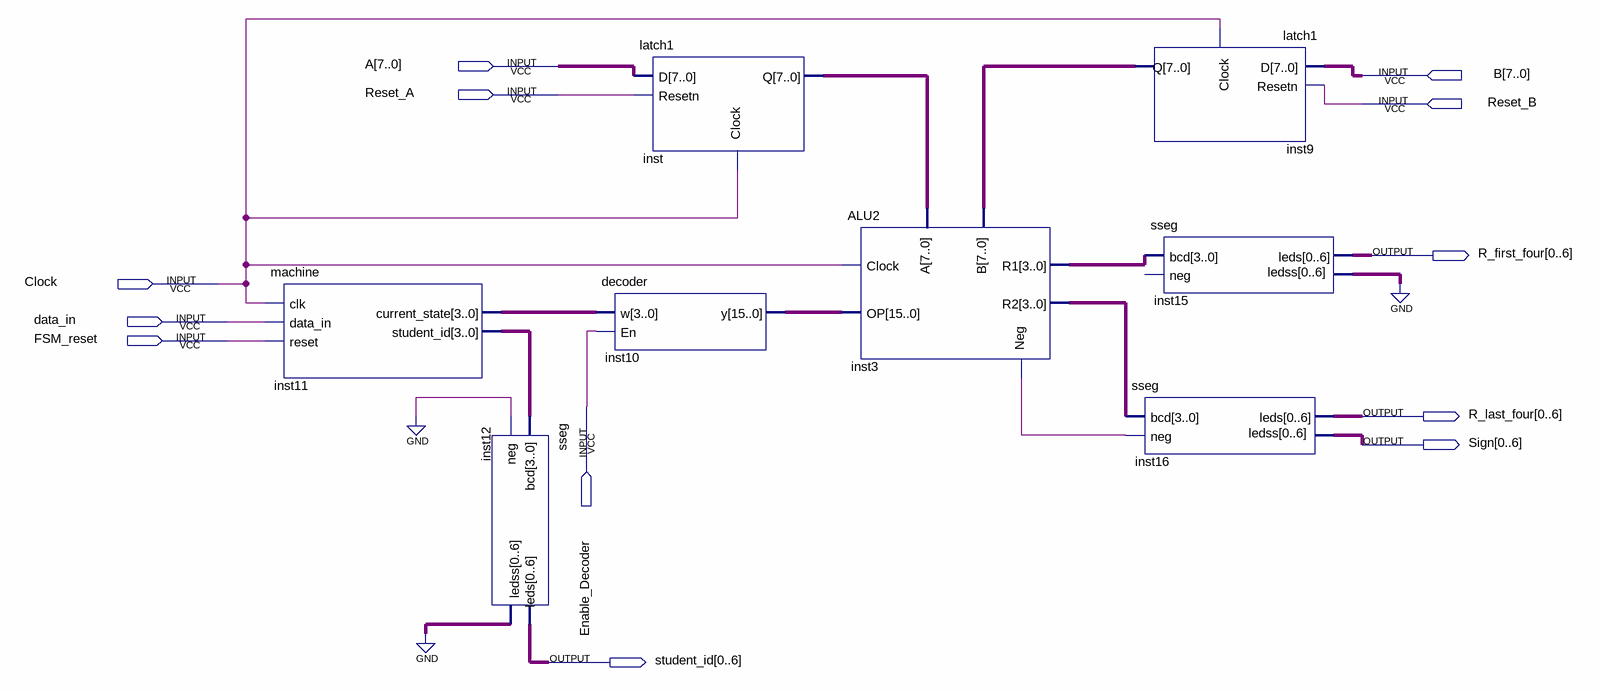
[diagram p0: schematic sheet]
// Quartus schematic problem2.bdf as structural Verilog: 8 symbols, 12 pins
module problem2 (
  input  [7:0] A,
  input  [7:0] B,
  input  Reset_A,
  input  Reset_B,
  input  Clock,
  input  data_in,
  input  FSM_reset,
  input  Enable_Decoder,
  output [0:6] R_first_four,
  output [0:6] R_last_four,
  output [0:6] Sign,
  output [0:6] student_id
);

  wire inst3_neg;
  wire [3:0] inst3_r1, inst3_r2, inst11_current_state, inst11_student_id;
  wire [6:0] inst12_ledss, inst15_ledss;
  wire [7:0] inst9_q, inst_q;
  wire [15:0] inst10_y;

  machine inst11 (
    .clk(Clock), .data_in(data_in), .reset(FSM_reset), .student_id(inst11_student_id),
    .current_state(inst11_current_state));
  sseg inst12 (.bcd(inst11_student_id), .neg(1'b0), .leds(student_id), .ledss(inst12_ledss));
  latch1 inst (.D(A), .Resetn(Reset_A), .Clock(Clock), .Q(inst_q));
  decoder inst10 (.w(inst11_current_state), .En(Enable_Decoder), .y(inst10_y));
  ALU2 inst3 (.Clock(Clock), .A(inst_q), .B(inst9_q), .OP(inst10_y), .Neg(inst3_neg), .R1(inst3_r1), .R2(inst3_r2));
  latch1 inst9 (.D(B), .Resetn(Reset_B), .Clock(Clock), .Q(inst9_q));
  sseg inst15 (.bcd(inst3_r1), .leds(R_first_four), .ledss(inst15_ledss));  // open: neg
  sseg inst16 (.bcd(inst3_r2), .neg(inst3_neg), .leds(R_last_four), .ledss(Sign));
  // also tied to GND on the sheet: {inst15_ledss[0], inst15_ledss[1], inst15_ledss[2], inst15_ledss[3], inst15_ledss[4], inst15_ledss[5], inst15_ledss[6], inst12_ledss[0], inst12_ledss[1], inst12_ledss[2], inst12_ledss[3], inst12_ledss[4], inst12_ledss[5], inst12_ledss[6]}
endmodule
